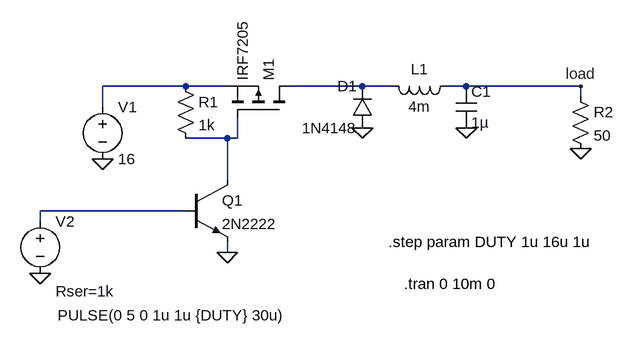
[diagram p0: schematic 381_final_project.asc]
381_final_project.asc, the LTspice schematic file:
Version 4
SHEET 1 880 680
WIRE 0 -32 -128 -32
WIRE 64 -32 0 -32
WIRE 272 -32 160 -32
WIRE 320 -32 272 -32
WIRE 432 -32 400 -32
WIRE 608 -32 432 -32
WIRE 608 -16 608 -32
WIRE -128 0 -128 -32
WIRE 64 48 0 48
WIRE 80 48 80 16
WIRE 80 48 64 48
WIRE 64 112 64 48
WIRE 0 160 -224 160
WIRE -224 176 -224 160
WIRE 64 224 64 208
FLAG -128 80 0
FLAG 64 224 0
FLAG 432 32 0
FLAG 272 32 0
FLAG 608 64 0
FLAG -224 256 0
FLAG 608 -32 load
SYMBOL npn 0 112 R0
SYMATTR InstName Q1
SYMATTR Value 2N2222
SYMBOL pmos 160 16 M270
SYMATTR InstName M1
SYMATTR Value IRF7205
SYMBOL voltage -128 -16 R0
WINDOW 123 0 0 Left 0
WINDOW 39 0 0 Left 0
SYMATTR InstName V1
SYMATTR Value 16
SYMBOL res -16 -48 R0
SYMATTR InstName R1
SYMATTR Value 1k
SYMBOL diode 288 32 R180
WINDOW 0 24 64 Left 2
WINDOW 3 24 0 Left 2
SYMATTR InstName D1
SYMATTR Value 1N4148
SYMBOL ind 416 -48 R90
WINDOW 0 5 56 VBottom 2
WINDOW 3 32 56 VTop 2
SYMATTR InstName L1
SYMATTR Value 4m
SYMBOL cap 416 -32 R0
SYMATTR InstName C1
SYMATTR Value 1µ
SYMBOL res 592 -32 R0
SYMATTR InstName R2
SYMATTR Value 50
SYMATTR SpiceLine pwr=1w
SYMBOL voltage -224 160 R0
WINDOW 123 0 0 Left 0
WINDOW 39 24 124 Left 2
WINDOW 3 27 161 Left 2
SYMATTR SpiceLine Rser=1k
SYMATTR Value PULSE(0 5 0 1u 1u {DUTY} 30u)
SYMATTR InstName V2
TEXT 336 272 Left 2 !.tran 0 10m 0
TEXT 312 208 Left 2 !.step param DUTY 1u 16u 1u

The netlist it stands for:
* 381_final_project.asc
Q1 N003 N004 0 0 2N2222
M1 N002 N003 N001 N001 IRF7205
V1 N001 0 16
R1 N001 N003 1k
D1 0 N002 1N4148
L1 load N002 4m
C1 load 0 1µ
R2 load 0 50 pwr=1w
V2 N004 0 PULSE(0 5 0 1u 1u {DUTY} 30u) Rser=1k
.model D D
.lib standard.dio
.model NPN NPN
.model PNP PNP
.lib standard.bjt
.model NMOS NMOS
.model PMOS PMOS
.lib standard.mos
.tran 0 10m 0
.step param DUTY 1u 16u 1u
.backanno
.end